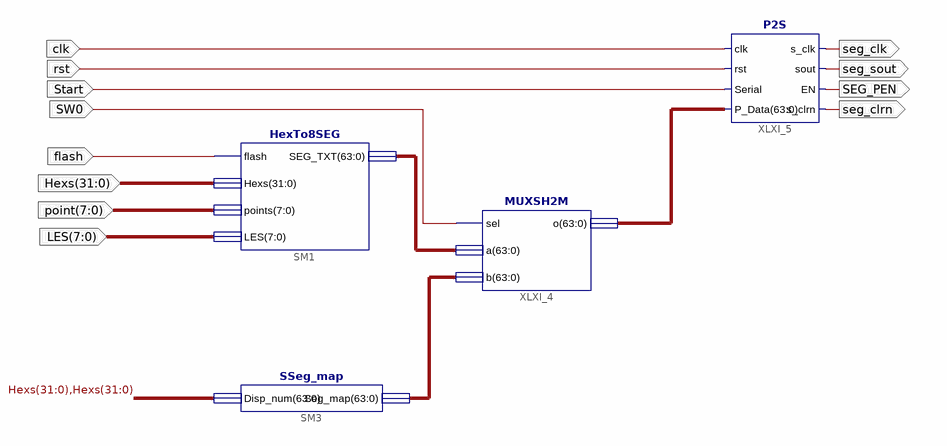
[diagram p0: schematic sheet 1]
// Xilinx ISE schematic Display.sch (kintex7) as structural Verilog: 4 symbols, 12 ports
module Display (
  input  clk,
  input  rst,
  input  Start,
  input  flash,
  input  [31:0] Hexs,
  input  [7:0] point,
  input  [7:0] LES,
  input  SW0,
  output seg_clk,
  output seg_sout,
  output SEG_PEN,
  output seg_clrn
);

  wire [63:0] XLXN_15, XLXN_16, XLXN_18;

  SSeg_map SM3 (.Disp_num({Hexs, Hexs}), .Seg_map(XLXN_16));
  MUXSH2M XLXI_4 (.sel(SW0), .a(XLXN_15), .b(XLXN_16), .o(XLXN_18));
  HexTo8SEG SM1 (.flash(flash), .Hexs(Hexs), .points(point), .LES(LES), .SEG_TXT(XLXN_15));
  P2S XLXI_5 (
    .clk(clk), .rst(rst), .Serial(Start), .P_Data(XLXN_18), .s_clk(seg_clk), .s_clrn(seg_clrn),
    .sout(seg_sout), .EN(SEG_PEN));
endmodule
